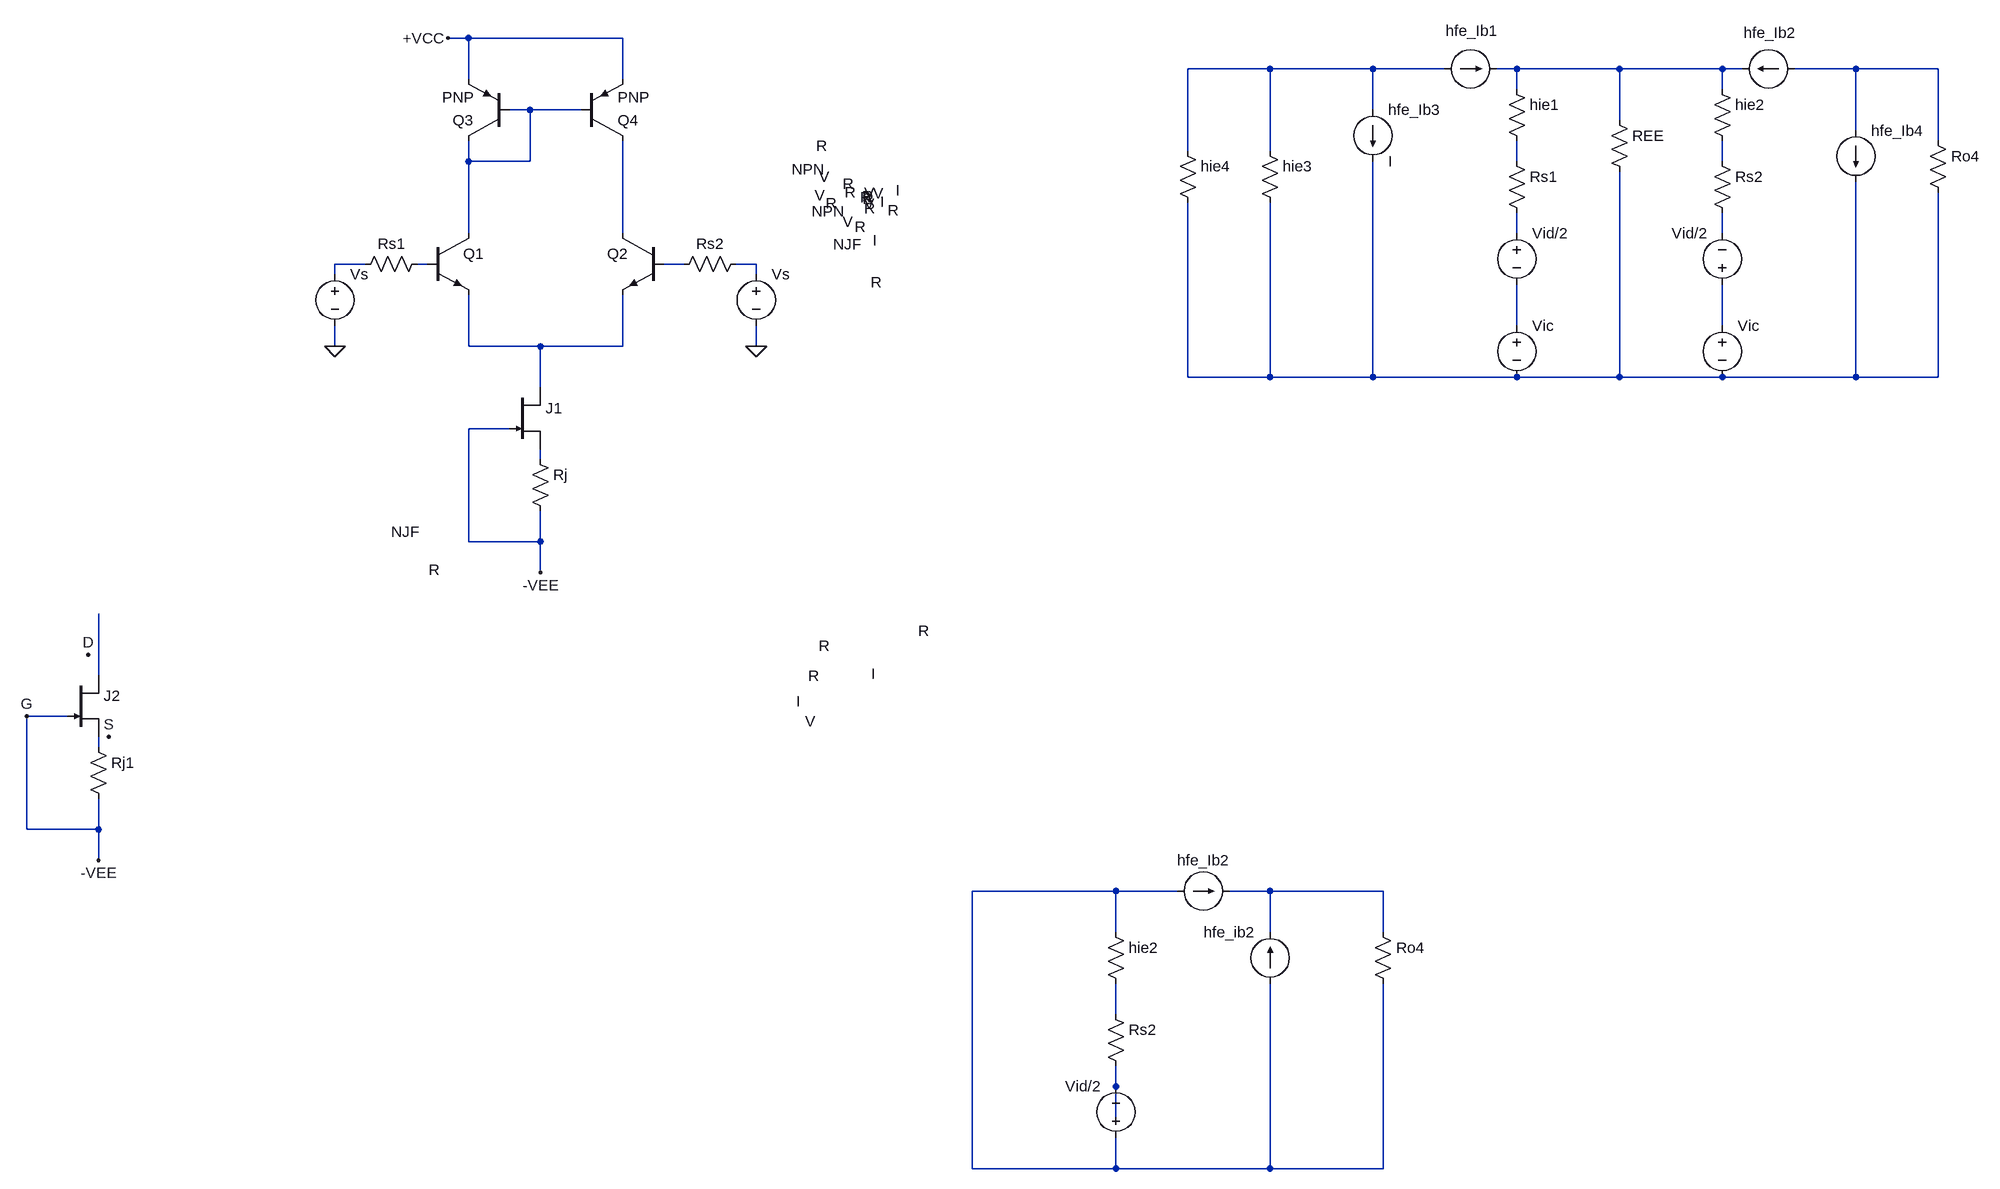
[diagram p0: schematic dibujos_segunda_tanda.asc]
dibujos_segunda_tanda.asc, the LTspice schematic file:
Version 4
SHEET 1 1992 1476
WIRE -496 -304 -528 -304
WIRE -256 -304 -496 -304
WIRE 752 -256 624 -256
WIRE 912 -256 752 -256
WIRE 1024 -256 912 -256
WIRE 1136 -256 1104 -256
WIRE 1296 -256 1136 -256
WIRE 1456 -256 1296 -256
WIRE 1488 -256 1456 -256
WIRE 1664 -256 1568 -256
WIRE 1792 -256 1664 -256
WIRE -496 -240 -496 -304
WIRE -256 -240 -256 -304
WIRE 1136 -224 1136 -256
WIRE 1456 -224 1456 -256
WIRE -400 -192 -432 -192
WIRE -320 -192 -400 -192
WIRE 912 -192 912 -256
WIRE 1296 -176 1296 -256
WIRE 1664 -160 1664 -256
WIRE 1792 -144 1792 -256
WIRE 624 -128 624 -256
WIRE 752 -128 752 -256
WIRE -496 -112 -496 -144
WIRE -400 -112 -400 -192
WIRE -400 -112 -496 -112
WIRE 1136 -112 1136 -144
WIRE 1456 -112 1456 -144
WIRE -496 0 -496 -112
WIRE -256 0 -256 -144
WIRE 1136 0 1136 -32
WIRE 1456 0 1456 -32
WIRE -656 48 -704 48
WIRE -560 48 -576 48
WIRE -160 48 -192 48
WIRE -48 48 -80 48
WIRE -704 64 -704 48
WIRE -48 64 -48 48
WIRE 1136 144 1136 80
WIRE 1456 144 1456 80
WIRE -704 176 -704 144
WIRE -496 176 -496 96
WIRE -384 176 -496 176
WIRE -256 176 -256 96
WIRE -256 176 -384 176
WIRE -48 176 -48 144
WIRE 624 224 624 -48
WIRE 752 224 752 -48
WIRE 752 224 624 224
WIRE 912 224 912 -112
WIRE 912 224 752 224
WIRE 1136 224 912 224
WIRE 1296 224 1296 -96
WIRE 1296 224 1136 224
WIRE 1456 224 1296 224
WIRE 1664 224 1664 -80
WIRE 1664 224 1456 224
WIRE 1792 224 1792 -64
WIRE 1792 224 1664 224
WIRE -384 240 -384 176
WIRE -432 304 -496 304
WIRE -384 352 -384 336
WIRE -496 480 -496 304
WIRE -384 480 -384 432
WIRE -384 480 -496 480
WIRE -384 528 -384 480
WIRE -1072 688 -1072 592
WIRE -1120 752 -1184 752
WIRE -1072 800 -1072 784
WIRE -1184 928 -1184 752
WIRE -1072 928 -1072 880
WIRE -1072 928 -1184 928
WIRE -1072 976 -1072 928
WIRE 512 1024 288 1024
WIRE 608 1024 512 1024
WIRE 752 1024 688 1024
WIRE 928 1024 752 1024
WIRE 512 1088 512 1024
WIRE 752 1088 752 1024
WIRE 928 1088 928 1024
WIRE 512 1216 512 1168
WIRE 512 1328 512 1296
WIRE 512 1376 512 1328
WIRE 288 1456 288 1024
WIRE 512 1456 512 1408
WIRE 512 1456 288 1456
WIRE 752 1456 752 1168
WIRE 752 1456 512 1456
WIRE 928 1456 928 1168
WIRE 928 1456 752 1456
FLAG -704 176 0
FLAG -48 176 0
FLAG -384 528 -VEE
FLAG -528 -304 +VCC
FLAG -1072 976 -VEE
FLAG -1088 656 D
FLAG -1184 752 G
FLAG -1056 784 S
SYMBOL npn -560 0 R0
WINDOW 3 567 -100 Left 2
SYMATTR InstName Q1
SYMBOL npn -192 0 M0
WINDOW 3 -281 -34 Left 2
SYMATTR InstName Q2
SYMBOL res -560 32 R90
WINDOW 0 0 56 VBottom 2
WINDOW 3 -94 -629 VTop 2
SYMATTR InstName Rs1
SYMBOL res -64 32 R90
WINDOW 0 0 56 VBottom 2
WINDOW 3 -184 -118 VTop 2
SYMATTR InstName Rs2
SYMBOL voltage -48 48 R0
WINDOW 3 135 -66 Left 2
SYMATTR InstName Vs
SYMBOL voltage -704 48 R0
WINDOW 3 747 -107 Left 2
SYMATTR InstName Vs
SYMBOL current 1024 -256 R270
WINDOW 0 44 42 VTop 2
WINDOW 3 -191 -876 VBottom 2
SYMATTR InstName hfe_Ib1
SYMBOL current 1568 -256 R90
WINDOW 0 -41 38 VBottom 2
WINDOW 3 251 1431 VTop 2
SYMATTR InstName hfe_Ib2
SYMBOL res 1120 -240 R0
WINDOW 3 -1030 176 Left 2
SYMATTR InstName hie1
SYMBOL res 1120 -128 R0
WINDOW 3 -1000 89 Left 2
SYMATTR InstName Rs1
SYMBOL res 1280 -192 R0
WINDOW 3 -1193 115 Left 2
SYMATTR InstName REE
SYMBOL res 1440 -240 R0
WINDOW 3 -1326 184 Left 2
SYMATTR InstName hie2
SYMBOL res 1440 -128 R0
WINDOW 3 -1322 74 Left 2
SYMATTR InstName Rs2
SYMBOL voltage 1136 -16 R0
WINDOW 3 -1086 -72 Left 2
SYMATTR InstName Vid/2
SYMBOL voltage 1456 96 R180
WINDOW 0 24 96 Left 2
WINDOW 3 1320 159 Left 2
SYMATTR InstName Vid/2
SYMBOL voltage 1136 128 R0
WINDOW 3 -1002 -190 Left 2
SYMATTR InstName Vic
SYMBOL voltage 1456 128 R0
WINDOW 3 -1336 -174 Left 2
SYMATTR InstName Vic
SYMBOL pnp -432 -144 R180
SYMATTR InstName Q3
SYMBOL pnp -320 -144 M180
SYMATTR InstName Q4
SYMBOL njf -432 240 R0
WINDOW 3 504 -223 Left 2
SYMATTR InstName J1
SYMBOL res -400 336 R0
WINDOW 3 530 -260 Left 2
SYMATTR InstName Rj
SYMBOL njf -1120 688 R0
WINDOW 3 504 -223 Left 2
SYMATTR InstName J2
SYMBOL res -1088 784 R0
WINDOW 3 530 -260 Left 2
SYMATTR InstName Rj1
SYMBOL res 496 1072 R0
WINDOW 3 -447 -430 Left 2
SYMATTR InstName hie2
SYMBOL res 912 1072 R0
WINDOW 3 -708 -453 Left 2
SYMATTR InstName Ro4
SYMBOL current 608 1024 R270
WINDOW 0 32 40 VTop 2
WINDOW 3 311 -590 VBottom 2
SYMATTR InstName hfe_Ib2
SYMBOL voltage 512 1424 R180
WINDOW 0 24 96 Left 2
WINDOW 3 468 664 Left 2
SYMATTR InstName Vid/2
SYMBOL current 752 1168 R180
WINDOW 0 24 80 Left 2
WINDOW 3 614 482 Left 2
SYMATTR InstName hfe_ib2
SYMBOL res 496 1200 R0
WINDOW 3 -463 -511 Left 2
SYMATTR InstName Rs2
SYMBOL res 736 -144 R0
WINDOW 3 -631 134 Left 2
SYMATTR InstName hie3
SYMBOL res 608 -144 R0
WINDOW 3 -491 86 Left 2
SYMATTR InstName hie4
SYMBOL res 1776 -160 R0
WINDOW 3 -1619 124 Left 2
SYMATTR InstName Ro4
SYMBOL current 1664 -160 R0
WINDOW 3 -1495 93 Left 2
SYMATTR InstName hfe_Ib4
SYMBOL current 912 -192 R0
SYMATTR InstName hfe_Ib3

The netlist it stands for:
* dibujos_segunda_tanda.asc
Q1 N004 N011 N016 0 NPN
Q2 N007 N012 N016 0 NPN
Rs1 N011 N010 R
Rs2 N013 N012 R
Vs N013 0 V
Vs N010 0 V
I§hfe_Ib1 N001 N002 I
I§hfe_Ib2 N003 N002 I
R§hie1 N002 N005 R
Rs1 N005 N008 R
REE N002 N017 R
R§hie2 N002 N006 R
Rs2 N006 N009 R
Vid/2 N008 N014 V
Vid/2 N015 N009 V
Vic N014 N017 V
Vic N015 N017 V
Q3 N004 N004 +VCC 0 PNP
Q4 N007 N004 +VCC 0 PNP
J1 N016 G N018 NJF
Rj N018 G R
J2 N019 G N020 NJF
Rj1 N020 G R
R§hie2 N021 N023 R
Ro4 N022 N021 R
I§hfe_Ib2 N021 N022 I
Vid/2 N021 N024 V
I§hfe_ib2 N021 N022 I
Rs2 N023 N024 R
R§hie3 N001 N017 R
R§hie4 N001 N017 R
Ro4 N003 N017 R
I§hfe_Ib4 N003 N017 I
I§hfe_Ib3 N001 N017 I
.model NPN NPN
.model PNP PNP
.lib standard.bjt
.model NJF NJF
.model PJF PJF
.lib standard.jft
.backanno
.end